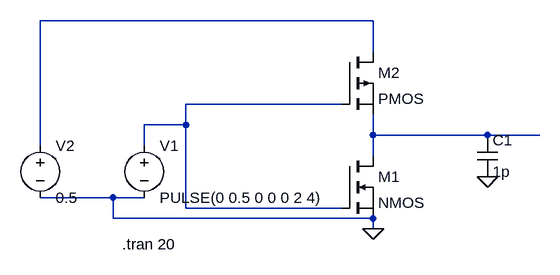
[diagram p0: schematic inveter.asc]
inveter.asc, the LTspice schematic file:
Version 4
SHEET 1 880 680
WIRE 224 144 -288 144
WIRE 224 192 224 144
WIRE 176 272 -64 272
WIRE -64 304 -64 272
WIRE -64 304 -128 304
WIRE 224 320 224 288
WIRE 400 320 224 320
WIRE 480 320 400 320
WIRE -288 336 -288 144
WIRE -128 336 -128 304
WIRE 224 352 224 320
WIRE -176 416 -288 416
WIRE -128 416 -176 416
WIRE -64 432 -64 304
WIRE 176 432 -64 432
WIRE -176 448 -176 416
WIRE 224 448 -176 448
WIRE 224 464 224 448
FLAG 224 464 0
FLAG 400 384 0
SYMBOL voltage -128 320 R0
WINDOW 123 0 0 Left 2
WINDOW 39 0 0 Left 2
SYMATTR InstName V1
SYMATTR Value PULSE(0 0.5 0 0 0 2 4)
SYMBOL voltage -288 320 R0
WINDOW 123 0 0 Left 2
WINDOW 39 0 0 Left 2
SYMATTR InstName V2
SYMATTR Value 0.5
SYMBOL nmos 176 352 R0
SYMATTR InstName M1
SYMBOL pmos 176 192 R0
SYMATTR InstName M2
SYMBOL cap 384 320 R0
SYMATTR InstName C1
SYMATTR Value 1p
TEXT -162 488 Left 2 !.tran 20

The netlist it stands for:
* inveter.asc
V1 N002 0 PULSE(0 0.5 0 0 0 2 4)
V2 N001 0 0.5
M1 N003 N002 0 0 NMOS
M2 N001 N002 N003 N003 PMOS
C1 N003 0 1p
.model NMOS NMOS
.model PMOS PMOS
.lib standard.mos
.tran 20
.backanno
.end